# Altium schematic sheet Microcontroller.SchDoc: Microcontroller
size A4; Revision: AA; SheetNumber: 2; SheetTotal: 6; ImagePath: "D:\git\altium-senior-project\gvsu_logo.jpg"
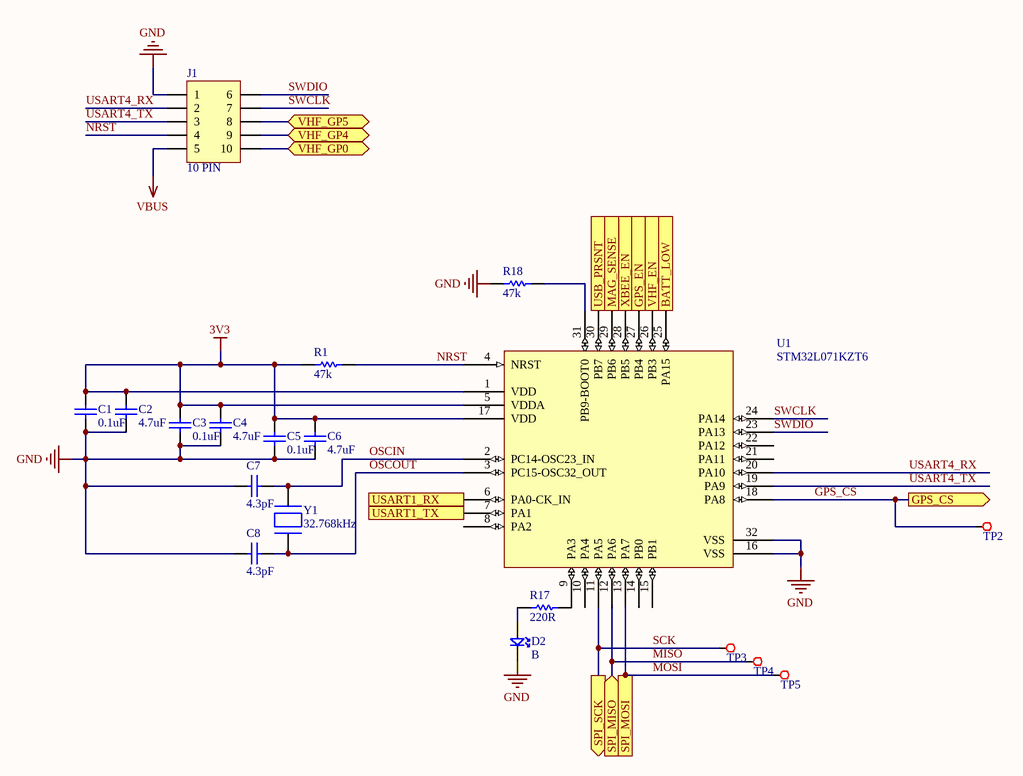
[diagram p0: Microcontroller.SchDoc]

## Parts
C1  value 0.1uF  [0402cap]  (hidden comment: C0402)
C2  value 4.7uF  [0603CAP]  (hidden comment: C0603)
C3  value 0.1uF  [0402cap]  (hidden comment: C0402)
C4  value 4.7uF  [0603CAP]  (hidden comment: C0603)
C5  value 0.1uF  [0402cap]  (hidden comment: C0402)
C6  value 4.7uF  [0603CAP]  (hidden comment: C0603)
C7  value 4.3pF  [0402cap]  (hidden comment: C0402)
C8  value 4.3pF  [0402cap]  (hidden comment: C0402)
D2  value B  [0603DDE]  (hidden comment: D0603)
J1  10 PIN  [FTSH-105-01-F-D-K]
R1  value 47k  [0402RES]  (hidden comment: R0402)
R17  value 220R  [0402RES]  (hidden comment: R0402)
R18  value 47k  [0402RES]  (hidden comment: R0402)
TP2  TESTPOINT  [TP R35 TH15]  (value not drawn)  (no BOM)
TP3  TESTPOINT  [TP R35 TH15]  (value not drawn)  (no BOM)
TP4  TESTPOINT  [TP R35 TH15]  (value not drawn)  (no BOM)
TP5  TESTPOINT  [TP R35 TH15]  (value not drawn)  (no BOM)
U1  STM32L071KZT6  [LQFP32]
Y1  32.768kHz  [0.126" L x 0.061" W (2 PAD)]

## Ports
BATT_LOW (in), GPS_CS (out), GPS_EN (out), MAG_SENSE (in), SPI_MISO (in), SPI_MOSI (out), SPI_SCK (out), USART1_RX (in), USART1_TX (out), USB_PRSNT (in), VHF_EN (out), VHF_GP0 (bidir), VHF_GP4 (bidir), VHF_GP5 (bidir), XBEE_EN (out)

## Nets
3V3: C1.2 C2.2 C3.2 C4.2 C5.2 C6.2 R1.1 U1.1(VDD) U1.5(VDDA) U1.17(VDD)
GND: C1.1 C2.1 C3.1 C4.1 C5.1 C6.1 C7.1 C8.1 D2.2 J1.1 R18.1 U1.16(VSS) U1.32(VSS)
VBUS: J1.5
BATT_LOW: U1.25(PA15) ; port BATT_LOW
GPS_CS: TP2.1 U1.18(PA8) ; port GPS_CS
GPS_EN: U1.27(PB4) ; port GPS_EN
MAG_SENSE: U1.29(PB6) ; port MAG_SENSE
MISO: TP4.1 U1.12(PA6) ; port SPI_MISO
MOSI: TP5.1 U1.13(PA7) ; port SPI_MOSI
NRST: J1.4 R1.2 U1.4(NRST)
OSCIN: C7.2 U1.2(PC14-OSC23_IN) Y1.2
OSCOUT: C8.2 U1.3(PC15-OSC32_OUT) Y1.1
SCK: TP3.1 U1.11(PA5) ; port SPI_SCK
SWCLK: J1.7 U1.24(PA14)
SWDIO: J1.6 U1.23(PA13)
USART1_RX: U1.6(PA0-CK_IN) ; port USART1_RX
USART1_TX: U1.7(PA1) ; port USART1_TX
USART4_RX: J1.2 U1.20(PA10)
USART4_TX: J1.3 U1.19(PA9)
USB_PRSNT: U1.30(PB7) ; port USB_PRSNT
VHF_EN: U1.26(PB3) ; port VHF_EN
VHF_GP0: J1.10 ; port VHF_GP0
VHF_GP4: J1.9 ; port VHF_GP4
VHF_GP5: J1.8 ; port VHF_GP5
XBEE_EN: U1.28(PB5) ; port XBEE_EN
NetD2_1: D2.1 R17.1
NetR17_2: R17.2 U1.9(PA3)
NetR18_2: R18.2 U1.31(PB9-BOOT0)

Not connected (* = marked no-connect by the designer): U1 8(PA2) 10(PA4) 14(PB0) 15(PB1) 21(PA11) 22(PA12)

## Notes on the sheet
- Title
- Size:
- Date:
- A4
- Number:
- Time:
- Revision:
- Sheet
- of
- Grand Valley State University
- 301 W Fulton St
- Grand Rapids, MI
- 49504
- File:

## Library data of the parts
C1 C3 C5 = C0402: 0402 Ceramic Chip Capacitor - Standard; Manufacturer 1: Samsung; Manufacturer Part Number 1: CL05B104KO5NNNC; Supplier 1: Digi-Key; Supplier Part Number 1: 1276-1001-1-ND
C2 C4 C6 = C0603: 0603 Ceramic Chip Capacitor - Standard
C7 C8 = C0402: 0402 Ceramic Chip Capacitor - Standard
D2 = D0603: 0603 SMD LED; ComponentLink1URL: *; Forward Voltage Drop: *
J1 = FTSH-105-01-F-D-K: 10 Pin Programming Header; Manufacturer 1: Samtec Inc.; Manufacturer Part Number 1: FTSH-105-01-F-D-K; Supplier 1: Digikey; Supplier Part Number 1: SAM8909-ND
R1 R17 R18 = R0402: 0402 Chip Resistor - Standard; ComponentLink1URL: *
TP2-TP5 = TP35TH10: 0.035"/0.015" Thru Hole Test Point; Part Number: 1617; Part Name: Testpoint
U1 = STM32L011K4T6: STMicro ARM M0+ Microcontroller; Manufacturer 1: STMicroelectronics; Manufacturer Part Number 1: STM32L071KZT6; Supplier 1: Digikey; Supplier Part Number 1: 497-18578-ND
Y1 = NX3215SA-32.768K-STD-MUA-8: NDK RTC 12.5pF Crystal SMD; Manufacturer 1: NDK; Manufacturer Part Number 1: NX3215SA-32.768K-STD-MUA-8; Supplier 1: Digikey; Supplier Part Number 1: 644-1156-1-ND